# EAGLE design Breakoutboardv2 (EAGLE 6.6.0)

## Sheet 1 of 2
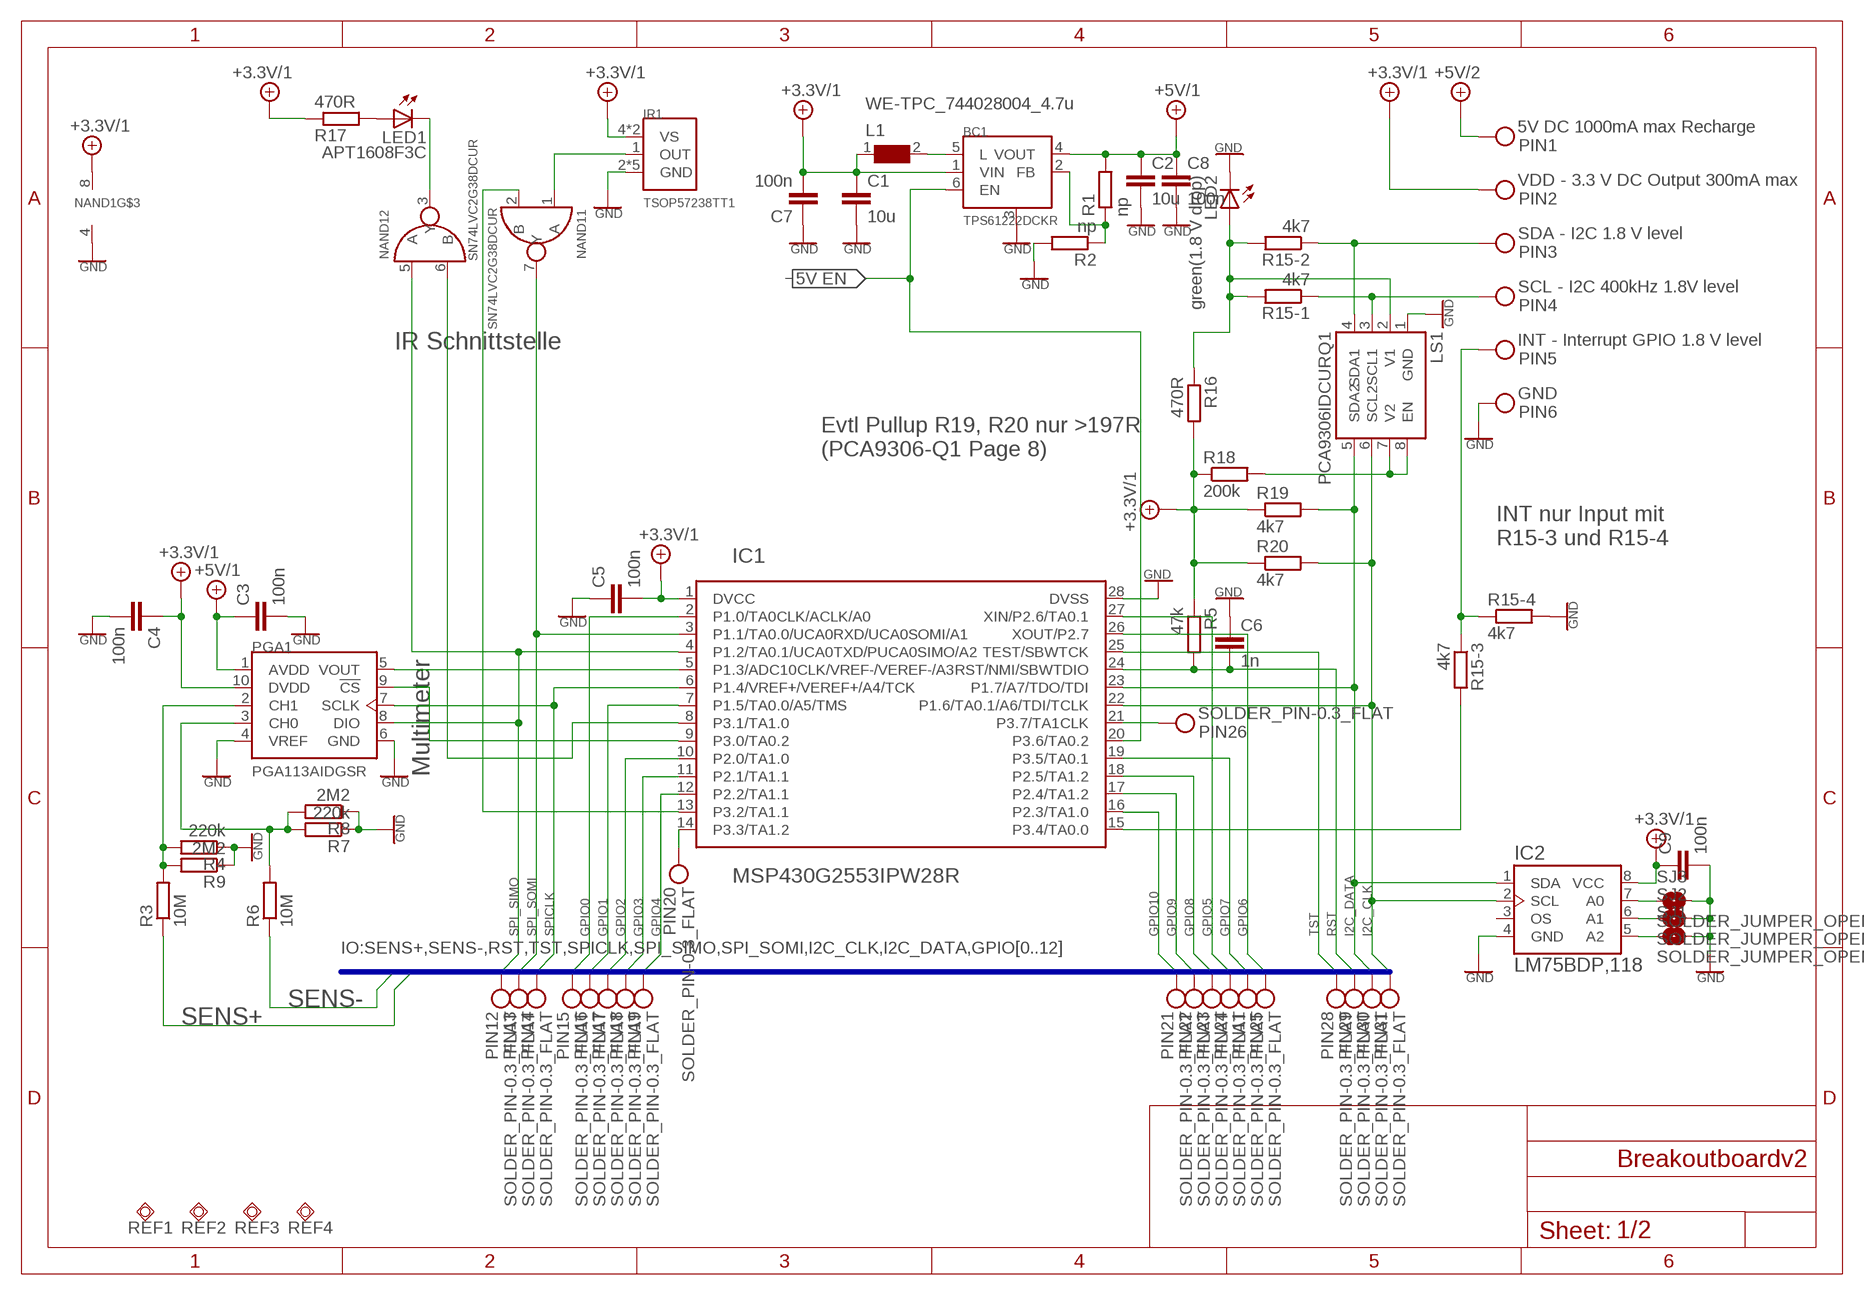
[diagram p0: schematic, sheet 1]

### Parts
BC1  TPS61222DCKR  [SOP65P210X110-6L]
C1  10u  C-EUC0805N  [CAPC2012X95N]
C2  10u  C-EUC0805N  [CAPC2012X95N]
C3  100n  C-EUC0603L  [CAPC1608X90L]
C4  100n  C-EUC0603L  [CAPC1608X90L]
C5  100n  C-EUC0603L  [CAPC1608X90L]
C6  1n  C-EUC0603L  [CAPC1608X90L]
C7  100n  C-EUC0603L  [CAPC1608X90L]
C8  100n  C-EUC0603L  [CAPC1608X90L]
C9  100n  C-EUC0603L  [CAPC1608X90L]
IC1  MSP430G2553IPW28R  [SOP65P640X120-28L]
IC2  LM75BDP,118  [SOP65P400X130-8L]
IR1  TSOP57238TT1  [TSOP572]
L1  WE-TPC_744028004_4.7u  WE-TPC_2811/2813  [WE-TPC_2811/2813]
LED1  APT1608F3C  LED0603  [LED-0603]
LED2  green(1.8 V drop)  LED0603  [LED-0603]
LS1  PCA9306IDCURQ1  [SOP50P310X90-8L]
NAND1  SN74LVC2G38DCUR  [SOP50P310X90-8L]
PGA1  PGA113AIDGSR  [SOP50P490X110-10L]
PIN1  5V DC 1000mA max Recharge  SOLDER_PIN-1.0_FLAT  [SOLDER_PIN_1_FLAT]
PIN2  VDD - 3.3 V DC Output 300mA max  SOLDER_PIN-1.0_FLAT  [SOLDER_PIN_1_FLAT]
PIN3  SDA - I2C 1.8 V level  SOLDER_PIN-1.0_FLAT  [SOLDER_PIN_1_FLAT]
PIN4  SCL - I2C 400kHz 1.8V level  SOLDER_PIN-1.0_FLAT  [SOLDER_PIN_1_FLAT]
PIN5  INT - Interrupt GPIO 1.8 V level  SOLDER_PIN-1.0_FLAT  [SOLDER_PIN_1_FLAT]
PIN6  GND  SOLDER_PIN-1.0_FLAT  [SOLDER_PIN_1_FLAT]
PIN11  SOLDER_PIN-0.3_FLAT  [SOLDER_PIN_0.3_FLAT]
PIN12  SOLDER_PIN-0.3_FLAT  [SOLDER_PIN_0.3_FLAT]
PIN13  SOLDER_PIN-0.3_FLAT  [SOLDER_PIN_0.3_FLAT]
PIN14  SOLDER_PIN-0.3_FLAT  [SOLDER_PIN_0.3_FLAT]
PIN15  SOLDER_PIN-0.3_FLAT  [SOLDER_PIN_0.3_FLAT]
PIN16  SOLDER_PIN-0.3_FLAT  [SOLDER_PIN_0.3_FLAT]
PIN17  SOLDER_PIN-0.3_FLAT  [SOLDER_PIN_0.3_FLAT]
PIN18  SOLDER_PIN-0.3_FLAT  [SOLDER_PIN_0.3_FLAT]
PIN19  SOLDER_PIN-0.3_FLAT  [SOLDER_PIN_0.3_FLAT]
PIN20  SOLDER_PIN-0.3_FLAT  [SOLDER_PIN_0.3_FLAT]
PIN21  SOLDER_PIN-0.3_FLAT  [SOLDER_PIN_0.3_FLAT]
PIN22  SOLDER_PIN-0.3_FLAT  [SOLDER_PIN_0.3_FLAT]
PIN23  SOLDER_PIN-0.3_FLAT  [SOLDER_PIN_0.3_FLAT]
PIN24  SOLDER_PIN-0.3_FLAT  [SOLDER_PIN_0.3_FLAT]
PIN25  SOLDER_PIN-0.3_FLAT  [SOLDER_PIN_0.3_FLAT]
PIN26  SOLDER_PIN-0.3_FLAT  [SOLDER_PIN_0.3_FLAT]
PIN28  SOLDER_PIN-0.3_FLAT  [SOLDER_PIN_0.3_FLAT]
PIN29  SOLDER_PIN-0.3_FLAT  [SOLDER_PIN_0.3_FLAT]
PIN30  SOLDER_PIN-0.3_FLAT  [SOLDER_PIN_0.3_FLAT]
PIN31  SOLDER_PIN-0.3_FLAT  [SOLDER_PIN_0.3_FLAT]
R1  np  R-EU-R0603L  [RESC1608X45L]
R2  np  R-EU-R0603L  [RESC1608X45L]
R3  10M  R-EU-R0603L  [RESC1608X45L]
R4  220k  R-EU-R0603L  [RESC1608X45L]
R5  47k  R-EU-R0603L  [RESC1608X45L]
R6  10M  R-EU-R0603L  [RESC1608X45L]
R7  220k  R-EU-R0603L  [RESC1608X45L]
R8  2M2  R-EU-R0603L  [RESC1608X45L]
R9  2M2  R-EU-R0603L  [RESC1608X45L]
R15  4k7  CTS-74,2C083  [R_ARRAY_742]
R16  470R  R-EU-R0603L  [RESC1608X45L]
R17  470R  R-EU-R0603L  [RESC1608X45L]
R18  200k  R-EU-R0603L  [RESC1608X45L]
R19  4k7  R-EU-R0603L  [RESC1608X45L]
R20  4k7  R-EU-R0603L  [RESC1608X45L]
REF1  PCB-REF-1.27  [PCB-REF]
REF2  PCB-REF-1.27  [PCB-REF]
REF3  PCB-REF-1.27  [PCB-REF]
REF4  PCB-REF-1.27  [PCB-REF]
SJ1  SOLDER_JUMPER_OPEN  [SJ-O]
SJ2  SOLDER_JUMPER_OPEN  [SJ-O]
SJ3  SOLDER_JUMPER_OPEN  [SJ-O]

### Nets
5VEN: BC1.6(EN) IC1.20(P3.6/TA0.2)
+3.3V/1: BC1.1(VIN) C1.1 C4.1 C5.2 C7.2 C9.1 IC1.1(DVCC) IC2.8(VCC) IR1.4(VS) IR1.5(VS) L1.1 NAND1.8(VDD) PGA1.10(DVDD) PIN2._(PIN) R5.1 R16.2 R17.1 R18.1 R19.1 R20.1 ; also sheet 2
+5V/1: BC1.4(VOUT) C2.1 C3.1 C8.1 PGA1.1(AVDD) R1.2 ; also sheet 2
+5V/2: PIN1._(PIN) ; also sheet 2
CS_PGA: IC1.9(P3.0/TA0.2) PGA1.9(!CS)
GND: BC1.3(GND) C1.2 C2.2 C3.2 C4.2 C5.1 C6.1 C7.1 C8.2 C9.2 IC1.28(DVSS) IC2.4(GND) IR1.2(GND) IR1.3(GND) IR1.6(GND) IR1.7(GND) IR1.8(GND) LED2.C LS1.1(GND) NAND1.4(GND) PGA1.4(VREF) PGA1.6(GND) PIN6._(PIN) R2.2 R4.1 R7.1 R8.1 R9.1 R15.5 SJ1.2 SJ2.2 SJ3.2 ; also sheet 2
GPIO0: IC1.2(P1.0/TA0CLK/ACLK/A0) PIN15._(PIN) ; also sheet 2
GPIO1: IC1.7(P1.5/TA0.0/A5/TMS) PIN16._(PIN) ; also sheet 2
GPIO2: IC1.10(P2.0/TA1.0) PIN17._(PIN) ; also sheet 2
GPIO3: IC1.11(P2.1/TA1.1) PIN18._(PIN) ; also sheet 2
GPIO4: IC1.12(P2.2/TA1.1) PIN19._(PIN) ; also sheet 2
GPIO5: IC1.27(XIN/P2.6/TA0.1) PIN24._(PIN) ; also sheet 2
GPIO6: IC1.26(XOUT/P2.7) PIN25._(PIN) ; also sheet 2
GPIO7: IC1.19(P3.5/TA0.1) PIN11._(PIN) ; also sheet 2
GPIO8: IC1.18(P2.5/TA1.2) PIN23._(PIN) ; also sheet 2
GPIO9: IC1.17(P2.4/TA1.2) PIN22._(PIN) ; also sheet 2
GPIO10: IC1.16(P2.3/TA1.0) PIN21._(PIN) ; also sheet 2
I2C_CLK: IC1.22(P1.6/TA0.1/A6/TDI/TCLK) IC2.2(SCL) LS1.6(SCL2) PIN31._(PIN) R20.2 ; also sheet 2
I2C_DATA: IC1.23(P1.7/A7/TDO/TDI) IC2.1(SDA) LS1.5(SDA2) PIN30._(PIN) R19.2 ; also sheet 2
INT_JOLLA: IC1.15(P3.4/TA0.0) R15.6
IR-R_CONT: IC1.13(P3.2/TA1.1) NAND1.2(1:B)
IR-T_CONT: IC1.8(P3.1/TA1.0) NAND1.6(2:B)
N$1: BC1.2(FB) R1.1 R2.1
N$2: BC1.5(L) L1.2
N$3: IC2.7(A0) SJ3.1
N$4: PGA1.2(CH1) R3.2 R4.2 R9.2
N$5: IC2.6(A1) SJ2.1
N$6: IC1.14(P3.3/TA1.2) PIN20._(PIN)
N$7: PGA1.3(CH0) R6.2 R7.2 R8.2
N$11: IC2.5(A2) SJ1.1
N$17: IC1.21(P3.7/TA1CLK) PIN26._(PIN)
N$18: LED1.A R17.2
N$19: PIN5._(PIN) R15.3 R15.4
N$21: LED2.A LS1.2(V1) R15.7 R15.8 R16.1
N$38: IR1.1(OUT) NAND1.1(1:A)
N$39: LED1.C NAND1.3(2:Y)
N$40: LS1.4(SDA1) PIN3._(PIN) R15.2
N$42: LS1.7(V2) LS1.8(EN) R18.2
N$43: LS1.3(SCL1) PIN4._(PIN) R15.1
RST: C6.2 IC1.24(RST/NMI/SBWTDIO) PIN29._(PIN) R5.2 ; also sheet 2
SENS+ [sens]: R3.1 ; also sheet 2
SENS- [sens]: R6.1 ; also sheet 2
SPI_SIMO: IC1.4(P1.2/TA0.1/UCA0TXD/PUCA0SIMO/A2) NAND1.5(2:A) PGA1.8(DIO) PIN12._(PIN) ; also sheet 2
SPI_SOMI: IC1.3(P1.1/TA0.0/UCA0RXD/UCA0SOMI/A1) NAND1.7(1:Y) PIN13._(PIN) ; also sheet 2
SPICLK: IC1.6(P1.4/VREF+/VEREF+/A4/TCK) PGA1.7(SCLK) PIN14._(PIN) ; also sheet 2
TST: IC1.25(TEST/SBWTCK) PIN28._(PIN) ; also sheet 2
VAD_SENSE: IC1.5(P1.3/ADC10CLK/VREF-/VEREF-/A3) PGA1.5(VOUT)
Unconnected: IC2.3(OS) REF1.0(PP) REF2.0(PP) REF3.0(PP) REF4.0(PP)

### Buses
IO:SENS+,SENS-,RST,TST,SPICLK,SPI_SIMO,SPI_SOMI,I2C_CLK,I2C_DATA,GPIO[0..12]

### Notes on the sheet
- IR Schnittstelle
- Evtl Pullup R19, R20 nur >197R
  (PCA9306-Q1 Page 8)
- INT nur Input mit
  R15-3 und R15-4
- Multimeter

## Sheet 2 of 2
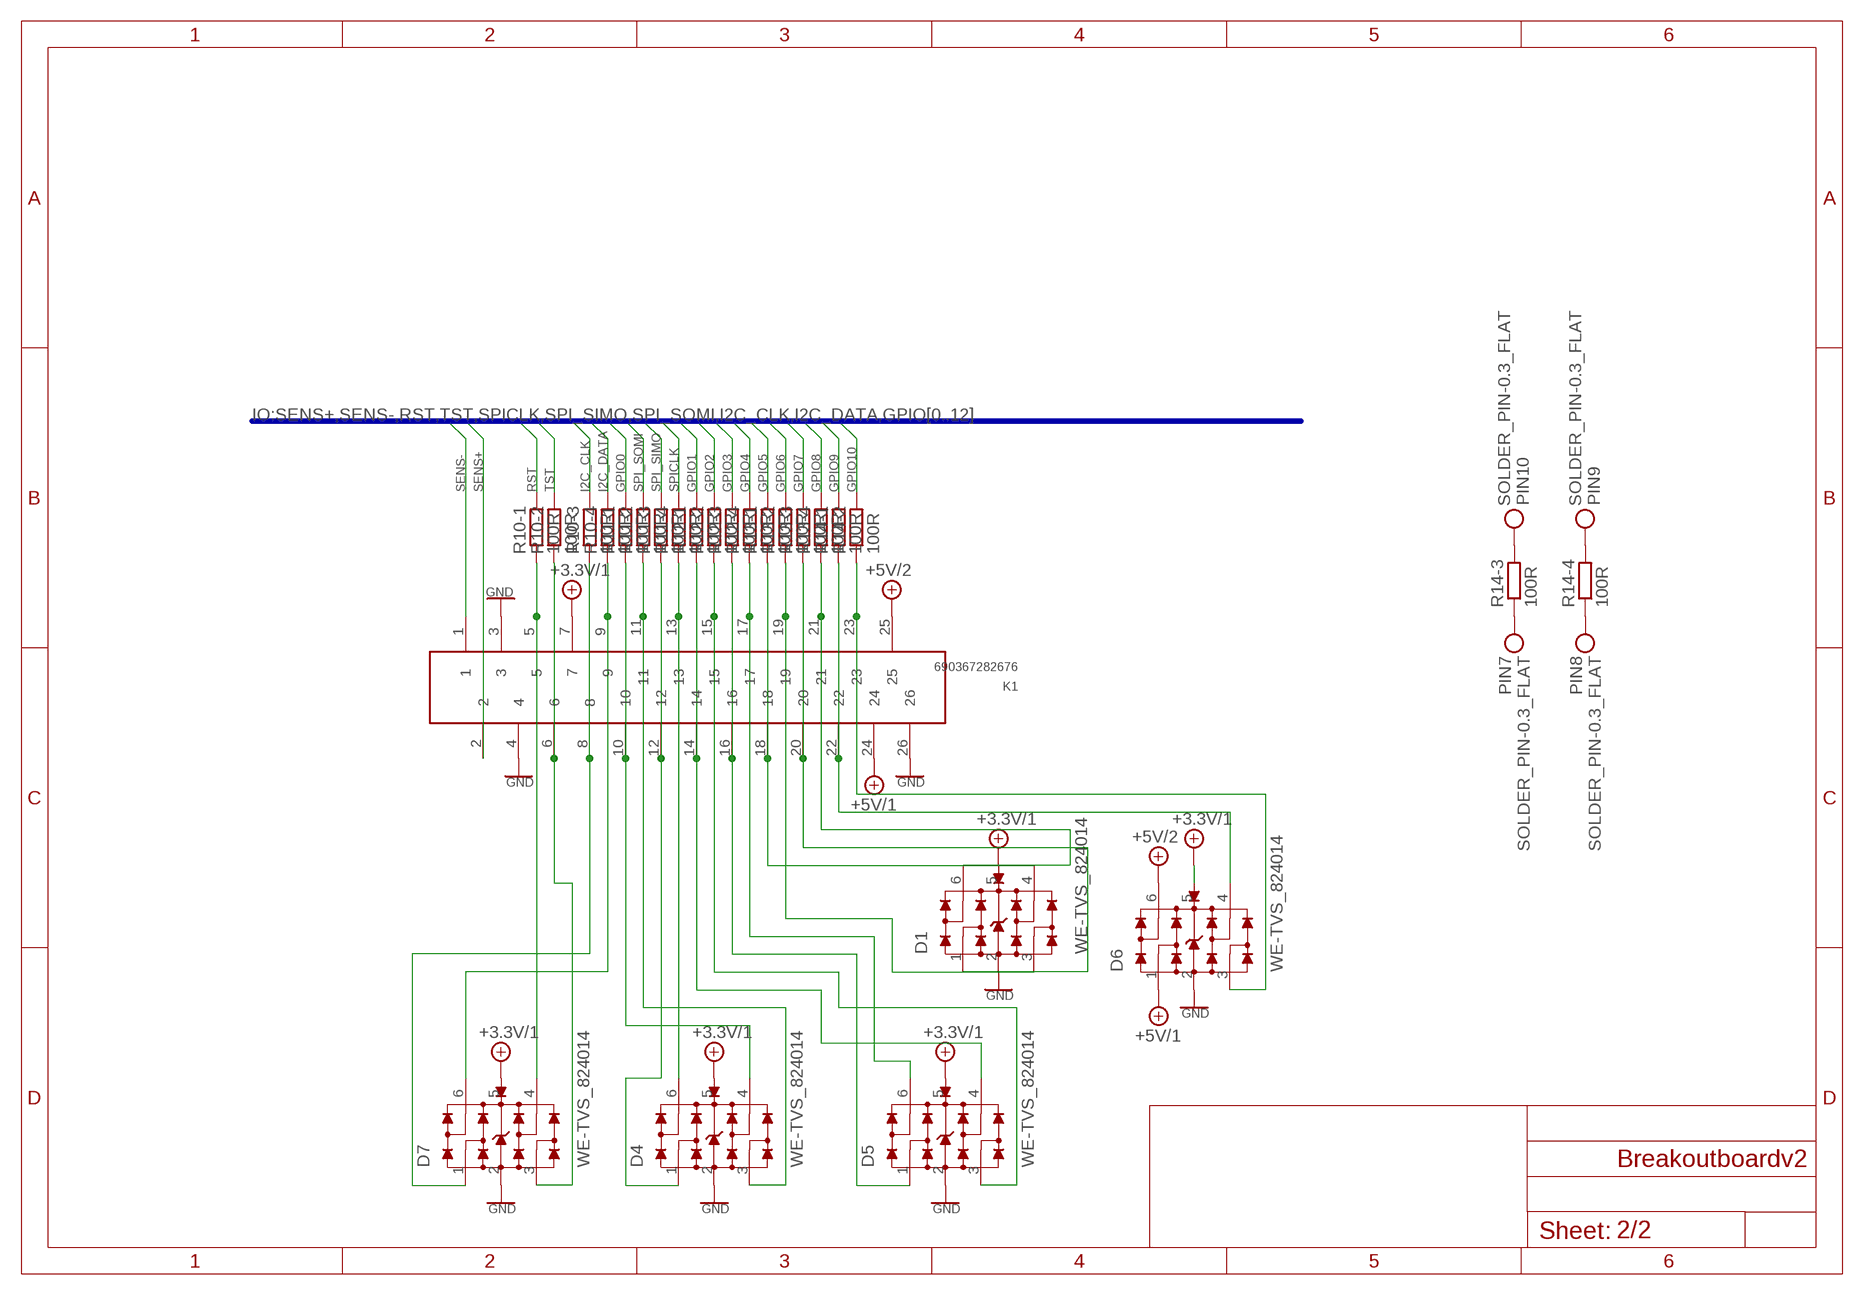
[diagram p1: schematic, sheet 2]

### Parts
D1  WE-TVS_824014  [WE-TVS_SOT23-6L]
D4  WE-TVS_824014  [WE-TVS_SOT23-6L]
D5  WE-TVS_824014  [WE-TVS_SOT23-6L]
D6  WE-TVS_824014  [WE-TVS_SOT23-6L]
D7  WE-TVS_824014  [WE-TVS_SOT23-6L]
K1  690367282676  [690367282676]
PIN7  SOLDER_PIN-0.3_FLAT  [SOLDER_PIN_0.3_FLAT]
PIN8  SOLDER_PIN-0.3_FLAT  [SOLDER_PIN_0.3_FLAT]
PIN9  SOLDER_PIN-0.3_FLAT  [SOLDER_PIN_0.3_FLAT]
PIN10  SOLDER_PIN-0.3_FLAT  [SOLDER_PIN_0.3_FLAT]
R10  100R  CTS-74,2C083  [R_ARRAY_742]
R11  100R  CTS-74,2C083  [R_ARRAY_742]
R12  100R  CTS-74,2C083  [R_ARRAY_742]
R13  100R  CTS-74,2C083  [R_ARRAY_742]
R14  100R  CTS-74,2C083  [R_ARRAY_742]

### Nets
+3.3V/1: D1.5(VDD) D4.5(VDD) D5.5(VDD) D6.5(VDD) D7.5(VDD) K1.7 ; also sheet 1
+5V/1: D6.1 K1.24 ; also sheet 1
+5V/2: D6.6 K1.25 ; also sheet 1
GND: D1.2(GND) D4.2(GND) D5.2(GND) D6.2(GND) D7.2(GND) K1.3 K1.4 K1.26 ; also sheet 1
GPIO0: R11.8 ; also sheet 1
GPIO1: R12.8 ; also sheet 1
GPIO2: R12.7 ; also sheet 1
GPIO3: R12.6 ; also sheet 1
GPIO4: R12.5 ; also sheet 1
GPIO5: R13.8 ; also sheet 1
GPIO6: R13.7 ; also sheet 1
GPIO7: R13.6 ; also sheet 1
GPIO8: R13.5 ; also sheet 1
GPIO9: R14.8 ; also sheet 1
GPIO10: R14.7 ; also sheet 1
I2C_CLK: R10.6 ; also sheet 1
I2C_DATA: R10.5 ; also sheet 1
N$8: D7.1 K1.8 R10.3
N$9: D7.6 K1.9 R10.4
N$10: D4.4 K1.10 R11.1
N$12: D4.1 K1.12 R11.3
N$13: D4.6 K1.13 R11.4
N$14: D5.4 K1.14 R12.1
N$15: D5.3 K1.15 R12.2
N$16: D5.1 K1.16 R12.3
N$24: D7.4 K1.5 R10.1
N$25: D7.3 K1.6 R10.2
N$26: D4.3 K1.11 R11.2
N$27: D5.6 K1.17 R12.4
N$28: D1.4 K1.18 R13.1
N$29: D1.3 K1.19 R13.2
N$30: D1.1 K1.20 R13.3
N$31: D1.6 K1.21 R13.4
N$32: D6.4 K1.22 R14.1
N$33: D6.3 K1.23 R14.2
N$34: PIN7._(PIN) R14.3
N$35: PIN8._(PIN) R14.4
N$36: PIN9._(PIN) R14.5
N$37: PIN10._(PIN) R14.6
RST: R10.8 ; also sheet 1
SENS+ [sens]: K1.2 ; also sheet 1
SENS- [sens]: K1.1 ; also sheet 1
SPI_SIMO: R11.6 ; also sheet 1
SPI_SOMI: R11.7 ; also sheet 1
SPICLK: R11.5 ; also sheet 1
TST: R10.7 ; also sheet 1

### Buses
IO:SENS+,SENS-,RST,TST,SPICLK,SPI_SIMO,SPI_SOMI,I2C_CLK,I2C_DATA,GPIO[0..12]

## Library data of the parts
BC1 = MasterPhonebot:TPS61222?*: TPS61222 Description The TPS6122x family devices provide a power-supply solution for products powered by either a single-cell, two-cell, or three-cell alkaline, NiCd or NiMH, or one-cell Li-Ion or Li-polymer battery. Possible output currents depend on the input-to-output voltage ratio. The boost converter is based on a hysteretic controller topology using synchronous rectification to obtain maximum efficiency at minimal quiescent currents. The output voltage of the adjustable version can be programmed by an external resistor divider, or is set internally to a fixed output voltage. The converter can be switched off by a featured enable pin. While being switched off, battery drain is minimized. The device is offered in a 6-pin SC-70 package (DCK) measuring 2 mm × 2 mm to enable small circuit layout size. Features Up to 95% Efficiency at Typical Operating Conditions 5.5 µA Quiescent Current Startup Into Load at 0.7 V Input Voltage Operating Input Voltage from 0.7 V to 5.5 V Pass-Through Function during Shutdown Minimum Switching Current 200 mA Protections: Output Overvoltage Overtemperature Input Undervoltage Lockout Adjustable Output Voltage from 1.8 V to 6 V Fixed Output Voltage Versions Small 6-pin SC-70 Package Details see: Datasheet <http://www.ti.com/lit/ds/symlink/tps61222.pdf> www.ti.com <http://www.ti.com/product/TPS61222> Created: L.Lischke 2015-03-21 (c) KK-Prime Engineering GmbH; SPQ: 3000
C1-C9 = MasterPhonebot:C-EU: Capacitor, European Symbol
D1 D4-D7 = MasterPhonebot:WE-TVS_824014: TVS Diode Array WE-TVS, Super Speed Serie - Low capazity - No leakage current - Low clamping voltage - high ESD voltage protection -- SATA -- DisplayPort -- DVI -- HDMI <http://katalog.we-online.de/media/images/eisos/VarTVS_highspeed_pf2.jpg.jpg> Details see: http://katalog.we-online.de/en/pbs/WE-TVS_High_Speed? Updated by Dan Xu 2014-07-11 2014 (C) Würth Elektronik
IC1 = MasterPhonebot:MSP430G2*53?28R: MSP430G2x53 Description The Texas Instruments MSP430 family of ultra-low-power microcontrollers consists of several devices featuring different sets of peripherals targeted for various applications. The architecture, combined with five low-power modes, is optimized to achieve extended battery life in portable measurement applications. The device features a powerful 16-bit RISC CPU, 16-bit registers, and constant generators that contribute to maximum code efficiency. The digitally controlled oscillator (DCO) allows wake-up from low-power modes to active mode in less than 1 µs. The MSP430G2x13 and MSP430G2x53 series are ultra-low-power mixed signal microcontrollers with built-in 16-bit timers, up to 24 I/O capacitive-touch enabled pins, a versatile analog comparator, and built-in communication capability using the universal serial communication interface. In addition the MSP430G2x53 family members have a 10-bit analog-to-digital (A/D) converter. For configuration details see . Typical applications include low-cost sensor systems that capture analog signals, convert them to digital values, and then process the data for display or for transmission to a host system. Features Low Supply-Voltage Range: 1.8 V to 3.6 V Ultra-Low Power Consumption Active Mode: 230 µA at 1 MHz, 2.2 V Standby Mode: 0.5 µA Off Mode (RAM Retention): 0.1 µA Five Power-Saving Modes Ultra-Fast Wake-Up From Standby Mode in Less Than 1 µs 16-Bit RISC Architecture, 62.5-ns Instruction Cycle Time Basic Clock Module Configurations Internal Frequencies up to 16 MHz With Four Calibrated Frequency Internal Very-Low-Power Low-Frequency (LF) Oscillator 32-kHz Crystal External Digital Clock Source Two 16-Bit Timer_A With Three Capture/Compare Registers Up to 24 Capacitive-Touch Enabled I/O Pins Universal Serial Communication Interface (USCI) Enhanced UART Supporting Auto Baudrate Detection (LIN) IrDA Encoder and Decoder Synchronous SPI I2C™ On-Chip Comparator for Analog Signal Compare Function or Slope Analog-to-Digital (A/D) Conversion 10-Bit 200-ksps Analog-to-Digital (A/D) Converter With Internal Reference, Sample-and-Hold, and Autoscan Brownout Detector Serial Onboard Programming, No External Programming Voltage Needed, Programmable Code Protection by Security Fuse On-Chip Emulation Logic With Spy-Bi-Wire Interface Package Options TSSOP: 20 Pin, 28 Pin PDIP: 20 Pin QFN: 32 Pin Details see: Datasheet <http://www.ti.com/lit/ds/symlink/msp430g2553.pdf> General Information: www.ti.com <http://www.ti.com/product/msp430g2553> Created: L.Lischke 2015-03-21 (c) KK-Prime Engineering GmbH
IC2 = MasterPhonebot:LM75B?*: LM75B Description The LM75B is a temperature-to-digital converter using an on-chip band gap temperature sensor and Sigma-Delta A-to-D conversion technique with an overtemperature detection output. The LM75B contains a number of data registers: Configuration register (Conf) to store the device settings such as device operation mode, OS operation mode, OS polarity and OS fault queue; temperature register (Temp) to store the digital temp reading, and set-point registers (Tos and Thyst) to store programmable overtemperature shutdown and hysteresis limits, that can be communicated by a controller via the 2-wire serial I²C-bus interface. The device also includes an open-drain output (OS) which becomes active when the temperature exceeds the programmed limits. There are three selectable logic address pins so that eight devices can be connected on the same bus without address conflict. The LM75B can be configured for different operation conditions. It can be set in normal mode to periodically monitor the ambient temperature, or in shutdown mode to minimize power consumption. The OS output operates in either of two selectable modes: OS comparator mode or OS interrupt mode. Its active state can be selected as either HIGH or LOW. The fault queue that defines the number of consecutive faults in order to activate the OS output is programmable as well as the set-point limits. The temperature register always stores an 11-bit two’s complement data giving a temperature resolution of 0.125 °C. This high temperature resolution is particularly useful in applications of measuring precisely the thermal drift or runaway. When the LM75B is accessed the conversion in process is not interrupted (that is, the I²C-bus section is totally independent of the Sigma-Delta converter section) and accessing the LM75B continuously without waiting at least one conversion time between communications will not prevent the device from updating the Temp register with a new conversion result. The new conversion result will be available immediately after the Temp register is updated. The LM75B powers up in the normal operation mode with the OS in comparator mode, temperature threshold of 80 °C and hysteresis of 75 °C, so that it can be used as a stand-alone thermostat with those pre-defined temperature set points. Features Pin-for-pin replacement for industry standard LM75 and LM75A and offers improved temperature resolution of 0.125 °C and specification of a single part over power supply range from 2.8 V to 5.5 V I²C-bus interface with up to 8 devices on the same bus Power supply range from 2.8 V to 5.5 V Temperatures range from -55 °C to +125 °C Frequency range 20 Hz to 400 kHz with bus fault time-out to prevent hanging up the bus 11-bit ADC that offers a temperature resolution of 0.125 °C Temperature accuracy of: ±2 °C from -25 °C to +100 °C ±3 °C from -55 °C to +125 °C Programmable temperature threshold and hysteresis set points Supply current of 1.0 uA in shutdown mode for power conservation Stand-alone operation as thermostat at power-up ESD protection exceeds 4500 V HBM per JESD22-A114 and 1000 V CDM per JESD22-C101 Latch-up testing is done to JEDEC Standard JESD78 which exceeds 100 mA Small 8-pin package types: SO8, TSSOP8, 3 mm x 2 mm XSON8U, and 2 mm x 3 mm HWSON8 Details see: Datasheet <http://www.nxp.com/documents/data_sheet/LM75B.pdf> More infos: www.nxp.com <http://www.nxp.com/products/interface_and_connectivity/i2c/i2c_temperature_voltage_monitors/LM75BDP.html> Created: L.Lischke 2015-04-05 (c) KK-Prime Engineering GmbH
IR1 = MasterPhonebot:TSOP57?*: IR-Receiver TSOP57xxxx Description IR Receiver Modules for Remote Control Systems Features Height of 0.8 mm ± 75° half angle sensitivity Low supply current Details see: Datasheet <http://www.vishay.com/docs/82434/tsop572.pdf> Further Details: www.vishay.com <http://www.vishay.com/product?docid=82646#geninf> Created: L.Lischke 2015-03-22 (c) KK-Prime-Engineering GmbH
K1 = MasterPhonebot:690367282676: WR-MM Female SMT Connector with Polarization, 26 Pins=>Code : Con_BTB_MM_Female_SMT_690367282676 <http://katalog.we-online.de/media/thumbs2/eican/thb_Con_BTB_MM_Female_SMT_69036728xx76_pf2.jpg> Details see: http://katalog.we-online.de/en/em/6903_6728_xx_76 Created 2014-06-04, Karrer Zheng 2014 (C) Würth Elektronik
L1 = MasterPhonebot:WE-TPC: Shielded Tiny Power Inductor WE-TPC - Extremely flat power inductor - High current capability - High reliability and perfect soldering characteristics because of integrated soldering pad - magnetically shielded -- Portable power like PDA, digital camera, PCMICA-cards and displays -- DC/DC-converter -- Recommended for switching regulator IC's from Linear Technology, National Semiconductor, Texas Instruments and Fairchild Semiconductor <http://katalog.we-online.de/media/images/eisos/IndTPC_pf2.jpg> Details see: http://katalog.we-online.de/en/pbs/WE-TPC? Updated by Dan Xu 2014-07-11 2014 (C) Würth Elektronik
LED1 LED2 = MasterPhonebot:LED: LEDs Standard schematic elements and footprints for 5mm, 3mm, 1206, and 0603 sized LEDs. 5mm - Spark Fun Electronics SKU : COM-00529 (and others)
LS1 = MasterPhonebot:PCA9306*?: I2C Levelshifter PCA9306-Q1 Description This dual bidirectional I2C and SMBus voltage-level translator, with an enable (EN) input, is operational from 1.2-V to 3.3-V VREF1 and 1.8-V to 5.5-V VREF2. The PCA9306 allows bidirectional voltage translations between 1.2 V and 5 V, without the use of a direction pin. The low ON-state resistance (ron) of the switch allows connections to be made with minimal propagation delay. When EN is high, the translator switch is ON, and the SCL1 and SDA1 I/O are connected to the SCL2 and SDA2 I/O, respectively, allowing bidirectional data flow between ports. When EN is low, the translator switch is off, and a high-impedance state exists between ports. In I2C applications, the bus capacitance limit of 400 pF restricts the number of devices and bus length. Using the PCA9306 enables the system designer to isolate two halves of a bus; thus, more I2C devices or longer trace length can be accommodated. The PCA9306 also can be used to run two buses, one at 400-kHz operating frequency and the other at 100-kHz operating frequency. If the two buses are operating at different frequencies, the 100-kHz bus must be isolated when the 400-kHz operation of the other bus is required. If the master is running at 400 kHz, the maximum system operating frequency may be less than 400 kHz because of the delays added by the repeater. As with the standard I2C system, pullup resistors are required to provide the logic high levels on the translator's bus. The PCA9306 has a standard open-collector configuration of the I2C bus. The size of these pullup resistors depends on the system, but each side of the repeater must have a pullup resistor. The device is designed to work with standard-mode and fast-mode I2C devices, in addition to SMBus devices. Standard-mode I2C devices only specify 3 mA in a generic I2C system where standard-mode devices and multiple masters are possible. Under certain conditions, high termination currents can be used. When the SDA1 or SDA2 port is low, the clamp is in the ON state, and a low resistance connection exists between the SDA1 and SDA2 ports. Assuming the higher voltage is on the SDA2 port when the SDA2 port is high, the voltage on the SDA1 port is limited to the voltage set by VREF1. When the SDA1 port is high, the SDA2 port is pulled to the drain pullup supply voltage (VDPU) by the pullup resistors. This functionality allows a seamless translation between higher and lower voltages selected by the user, without the need for directional control. The SCL1/SCL2 channel also functions as the SDA1/SDA2 channel. All channels have the same electrical characteristics, and there is minimal deviation from one output to another in voltage or propagation delay. This is a benefit over discrete transistor voltage translation solutions, since the fabrication of the switch is symmetrical. The translator provides excellent ESD protection to lower-voltage devices and at the same time protects less ESD-resistant devices. Features Qualified for Automotive Applications AEC-Q100 Qualified With the Following Results: Device Temperature Grade 2: –40°C to 105°C Device HBM ESD Classification Level H2 Device CDM ESD Classification Level C4B 2-Bit Bidirectional Translator for SDA and SCL Lines in Mixed-Mode I2C Applications I2C and SMBus Compatible Less Than 1.5-ns Maximum Propagation Delay to Accommodate Standard-Mode and Fast-Mode I2C Devices and Multiple Masters Allows Voltage-Level Translation Between 1.2-V VREF1 and 1.8-V, 2.5-V, 3.3-V, or 5-V VREF2 1.8-V VREF1 and 2.5-V, 3.3-V or 5-V VREF2 2.5-V VREF1 and 3.3-V or 5-V VREF2 3.3-V VREF1 and 5-V VREF2 Provides Bidirectional Voltage Translation With No Direction Pin Low 3.5-Ω ON-State Connection Between Input and Output Ports Provides Less Signal Distortion Open-Drain I2C I/O Ports (SCL1, SDA1, SCL2, and SDA2) 5-V Tolerant I2C I/O Ports to Support Mixed-Mode Signal Operation High-Impedance SCL1, SDA1, SCL2, and SDA2 Pins for EN = Low Lock-Up-Free Operation for Isolation When EN = Low Flow-Through Pinout for Ease of Printed Circuit Board Trace Routing Latch-Up Performance Exceeds 100 mA Per JESD 78, Class II ESD Protection Exceeds JESD 22 2000-V Human-Body Model (A114-A) 200-V Machine Model (A115-A) 1000-V Charged-Device Model (C101) Details see: Datasheet <http://www.ti.com/lit/ds/symlink/pca9306-q1.pdf> General Information: www.ti.com <http://www.ti.com/product/pca9306-q1> Created: L.Lischke 2015-03-23 (c) KK-Prime Engineering GmbH; OPTEMP: -40 to 85 °C
NAND1 = MasterPhonebot:SN74LVC2G38?*: SN74LVC2G38 Description The SN74LVC2G38 is designed for 1.65-V to 5.5-V VCC operation. This device is a dual two-input NAND buffer gate with open-drain outputs. It performs the Boolean function Y = A • B or Y = A + B in positive logic. NanoFree™ package technology is a major breakthrough in IC packaging concepts, using the die as the package. This device is fully specified for partial-power-down applications using Ioff. The Ioff circuitry disables the outputs, preventing damaging current backflow through the device when it is powered down. Features Available in the Texas Instruments NanoFree Package Supports 5-V VCC Operation Inputs Accept Voltages to 5.5 V Max tpd of 4 ns at 3.3 V Low Power Consumption, 10-μA Max ICC ±24-mA Output Drive at 3.3 V Typical VOLP (Output Ground Bounce) <0.8 V at VCC = 3.3 V, TA = 25°C Typical VOHV (Output VOH Undershoot) >2 V at VCC = 3.3 V, TA = 25°C Ioff Supports Live insertion, Partial-Power-Down Mode Operation and Back Drive Protection Latch-Up Performance Exceeds 100 mA Per JESD 78, Class II ESD Protection Exceeds JESD 22 2000-V Human-Body Model (A114-A) 200-V Machine Model (A115-A) 1000-V Charged-Device Model (C101) Details see: Datasheet <http://www.ti.com/lit/ds/symlink/sn74lvc2g38.pdf> General Details: www.ti.com <http://www.ti.com/product/sn74lvc2g38> Created: L.Lischke 2015-03-23 (c) KK-Prime Engineering GmbH
PGA1 = MasterPhonebot:PGA11: PGA113 Description The PGA112 and PGA113 (binary/scope gains) offer two analog inputs, a three-pin SPI interface, and software shutdown in an MSOP-10 package. The PGA116 and PGA117 (binary/scope gains) offer 10 analog inputs, a four-pin SPI interface with daisy-chain capability, and hardware and software shutdown in a TSSOP-20 package. All versions provide internal calibration channels for system-level calibration. The channels are tied to GND, 0.9VCAL, 0.1VCAL, and VREF, respectively. VCAL, an external voltage connected to Channel 0, is used as the system calibration reference. Binary gains are: 1, 2, 4, 8, 16, 32, 64, and 128; scope gains are: 1, 2, 5, 10, 20, 50, 100, and 200. Features Rail-to-Rail Input/Output Offset: 25µV (typ), 100µV (max) Zerø-Drift: 0.35µV/°C (typ), 1.2µV/°C (max) Low Noise: 12nV/√Hz Input Offset Current: ±5nA max (+25°C) Gain Error: 0.1% max (G ≤ 32), 0.3% max (G > 32) Binary Gains: 1, 2, 4, 8, 16, 32, 64, 128(PGA112, PGA116) Scope Gains: 1, 2, 5, 10, 20, 50, 100, 200 (PGA113, PGA117) Gain Switching Time: 200ns Two Channel MUX: PGA112, PGA113 10 Channel MUX: PGA116, PGA117 Four Internal Calibration Channels Amplifier Optimized for Driving CDAC ADCs Output Swing: 50mV to Supply Rails AVDD and DVDD for Mixed Voltage Systems IQ = 1.1mA (typ) Software/Hardware Shutdown: IQ ≤ 4µA (typ) Temperature Range: -40°C to +125°C SPI Interface (10MHz) with Daisy-Chain Capability APPLICATIONS Remote e-Meter Reading Automatic Gain Control Portable Data Acquisition PC-Based Signal Acquisition Systems Test and Measurement Programmable Logic Controllers Battery-Powered Instruments Handheld Test Equipment Details see: Datasheet <http://www.ti.com/lit/ds/symlink/pga113.pdf> General Informations: www.ti.com <http://www.ti.com/product/PGA113> Created: L.Lischke 2015-03-21 (c) KK-Prime Engineering GmbH; GAINS: Scope
PIN1-PIN26 PIN28-PIN31 = MasterPhonebot:SOLDER_PIN: Simple Solder pin Created G. Klenner, 2013 (C) K&K Prime Engineering GmbH
R1-R9 R16-R20 = MasterPhonebot:R-EU: Resistor, European Symbol
R10-R15 = MasterPhonebot:CTS-74: Chip Resistor Arrays Series 74x Features Low Cost Thick Film Technology High Density Packaging Low Profile; can be used in PCMCIA cards Leadless Surface Mount Construction Concave or Convex Terminations Solder Coated Nickel Barrier Pads Isolated and Bussed Circuits Resistor Arrays Require Fewer Placements Than Discrete Components Tape and Reel Packaging RoHS Compliant in Accordance with EU Directive 2005/95/EC View All Features in Datasheet <http://www.ctscorp.com/components/Datasheets/CTSChipArrayDs.pdf> Details see: www.ctscorp.com Created A. Bachmaier, K&K Prime Engineering GmbH (c) 2011; 0_HOUSING: 1206; 0_MANUF: CTS; 1_DISTR: Digi-Key; 1_PN: 742C083103JPCT-ND
REF1-REF4 = MasterPhonebot:PCB-REF: reference point for PCB population Created G. Klenner, 2011-09-21 (c) K&K Prime Engineering GmbH
SJ1-SJ3 = MasterPhonebot:SOLDER_JUMPER: SMD solder JUMPER

## Net classes
1 sens: width 0.3 mm, drill 0.6 mm, clearance 1 mm

## Board
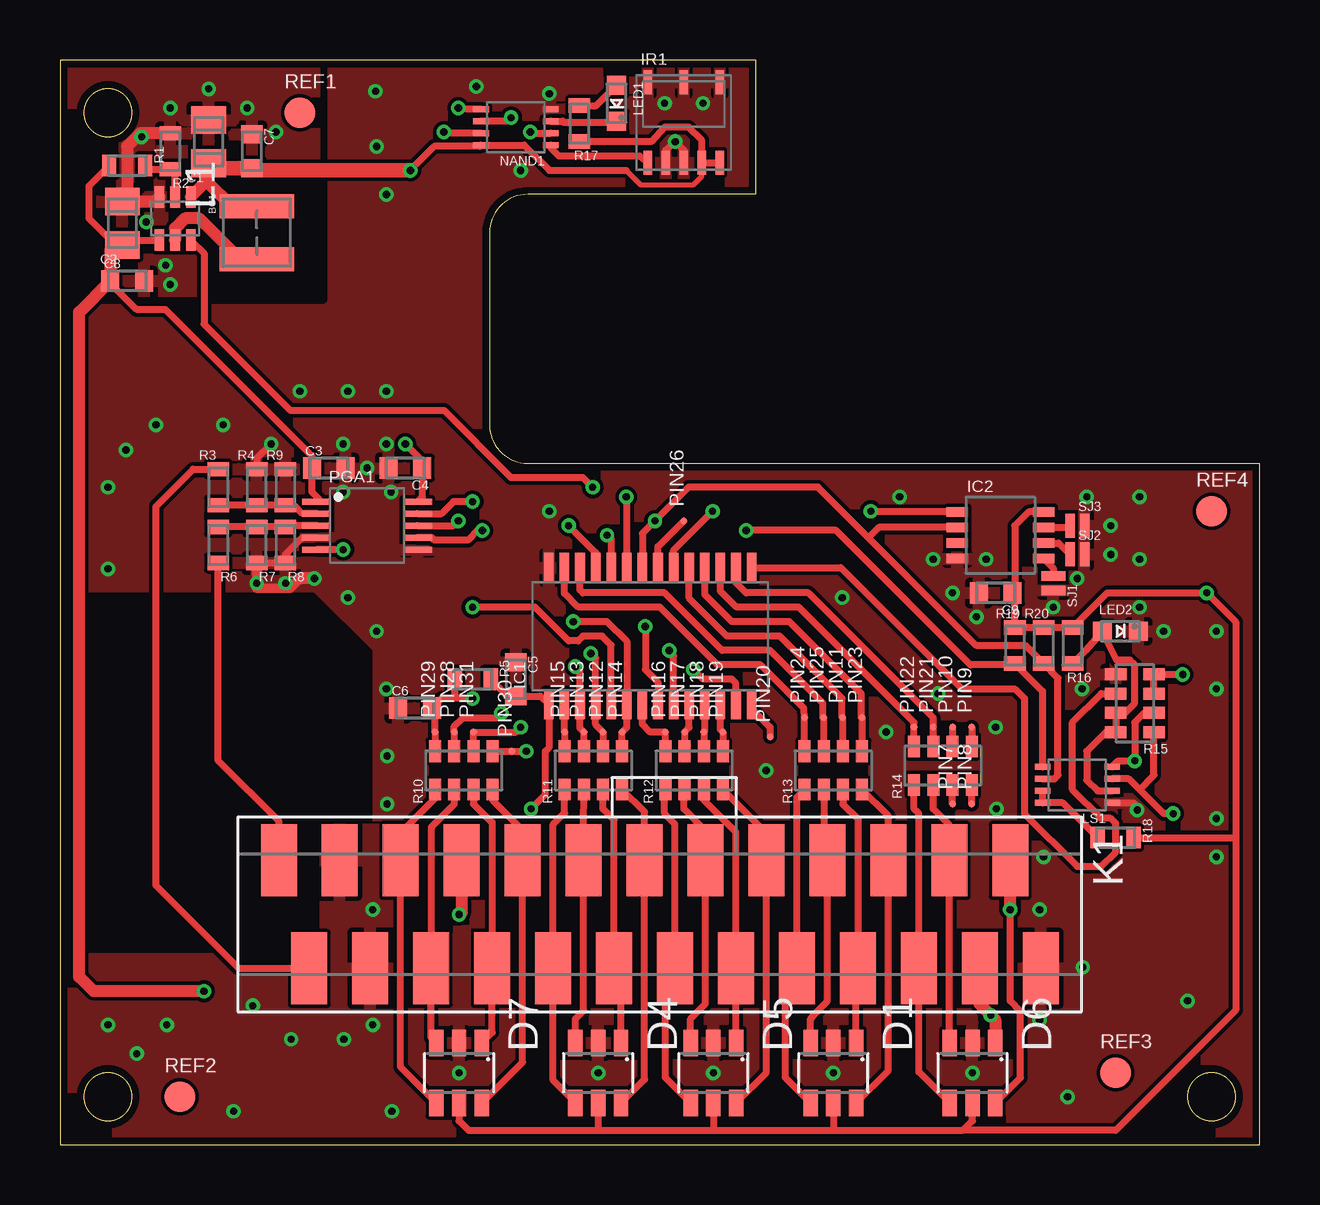
[diagram p2: board, top side]
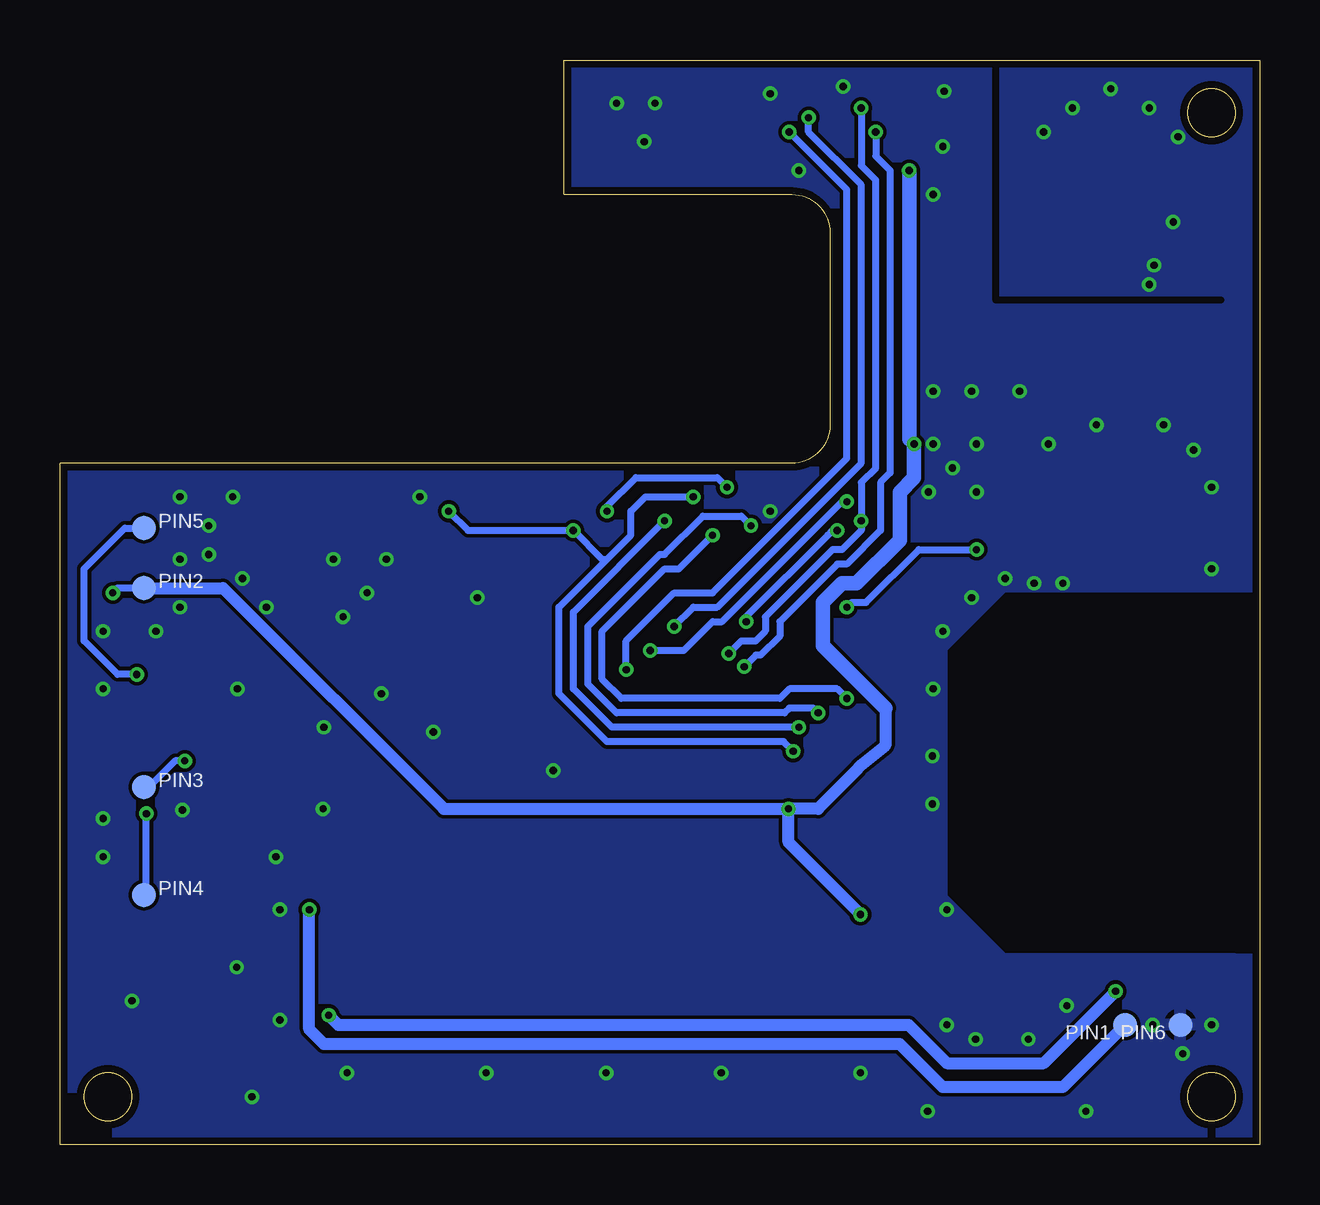
[diagram p3: board, bottom side, seen from below]

Size 50 x 45.2 mm. Coordinates in mm from the lower left corner, seen from the top.
Outline: 0,0 50,0 50,28.4 19.5,28.4 arc-90 17.9,30 17.9,38 arc-90 19.5,39.6 29,39.6 29,45.2 0,45.2 0,0
Outline: circle at 2,43 radius 1
Outline: circle at 2,2 radius 1
Outline: circle at 48,2 radius 1
Copper layers (1*16): Top 0.035mm / dielectric 1.5mm / Bottom 0.035mm
Design rules "Eagle-DRU - 1109 - LeitOn - 01 and 02 layers KK": minimum track width 0.15mm, minimum drill 0.3mm, track to track 0.15mm, track to pad 0.15mm, pad to pad 0.15mm, via to via 0.15mm, smd to smd 0.15mm, copper to edge 0.3mm, drill to drill 0.3mm, minimum pad ring 0.15mm, minimum via ring 0.15mm, stop-mask expansion 0.05mm, vias tented up to drill 0.3mm, thermal gap 0.2mm
tRestrict: area 1,8 to 13,23; 3 lines
bRestrict: area 1,8 to 13,23; 4 lines

### Footprints (pad centres in the part's own frame; a part is rotated, then mirrored left to right if it is on the bottom)
SOP65P210X110-6L = smd 0.9 x 0.4: 1 -0.9,0.65; 2 -0.9,0; 3 -0.9,-0.65; 4 0.9,-0.65; 5 0.9,0; 6 0.9,0.65
CAPC2012X95N = smd 1.15 x 1.45: 1 0.9,0; 2 -0.9,0
CAPC1608X90L = smd 0.75 x 0.9: 1 -0.7,0; 2 0.7,0
WE-TVS_SOT23-6L = smd 0.6 x 1.1: 1 -0.95,-1.25; 2 0,-1.25; 3 0.95,-1.25; 4 0.95,1.25; 5 0,1.25; 6 -0.95,1.25
SOP65P640X120-28L = smd 1.25 x 0.4: 1 -2.85,4.225; 2 -2.85,3.575; 3 -2.85,2.925; 4 -2.85,2.275; 5 -2.85,1.625; 6 -2.85,0.975; 7 -2.85,0.325; 8 -2.85,-0.325; 9 -2.85,-0.975; 10 -2.85,-1.625; 11 -2.85,-2.275; 12 -2.85,-2.925; 13 -2.85,-3.575; 14 -2.85,-4.225; 15 2.85,-4.225; 16 2.85,-3.575; 17 2.85,-2.925; 18 2.85,-2.275; 19 2.85,-1.625; 20 2.85,-0.975; 21 2.85,-0.325; 22 2.85,0.325; 23 2.85,0.975; 24 2.85,1.625; 25 2.85,2.275; 26 2.85,2.925; 27 2.85,3.575; 28 2.85,4.225
SOP65P400X130-8L = smd 0.9 x 0.4: 1 -1.8,0.975; 2 -1.8,0.325; 3 -1.8,-0.325; 4 -1.8,-0.975; 5 1.8,-0.975; 6 1.8,-0.325; 7 1.8,0.325; 8 1.8,0.975
TSOP572 = smd 0.35 x 1: 1 -1.5,-1.675; 2 -0.75,-1.675; 3 0,-1.675; 4 0.75,-1.675; 5 1.5,-1.675; 6 1.5,1.675; 7 0,1.675; 8 -1.5,1.675
690367282676 = smd 1.5 x 3: 1 15.875,-2.25; 2 14.605,2.25; 3 13.335,-2.25; 4 12.065,2.25; 5 10.795,-2.25; 6 9.525,2.25; 7 8.255,-2.25; 8 6.985,2.25; 9 5.715,-2.25; 10 4.445,2.25; 11 3.175,-2.25; 12 1.905,2.25; 13 0.635,-2.25; 14 -0.635,2.25; 15 -1.905,-2.25; 16 -3.175,2.25; 17 -4.445,-2.25; 18 -5.715,2.25; 19 -6.985,-2.25; 20 -8.255,2.25; 21 -9.525,-2.25; 22 -10.795,2.25; 23 -12.065,-2.25; 24 -13.335,2.25; 25 -14.605,-2.25; 26 -15.875,2.25
WE-TPC_2811/2813 = smd 1 x 3.1: 1 -1.1,0; 2 1.1,0
LED-0603 = smd 0.8 x 0.8: A 0,-0.75; C 0,0.75
SOP50P310X90-8L = smd 0.65 x 0.25: 1 -1.45,0.75; 2 -1.45,0.25; 3 -1.45,-0.25; 4 -1.45,-0.75; 5 1.45,-0.75; 6 1.45,-0.25; 7 1.45,0.25; 8 1.45,0.75
SOP50P490X110-10L = smd 1.2 x 0.25: 1 -2.1,1; 2 -2.1,0.5; 3 -2.1,0; 4 -2.1,-0.5; 5 -2.1,-1; 6 2.1,-1; 7 2.1,-0.5; 8 2.1,0; 9 2.1,0.5; 10 2.1,1
SOLDER_PIN_1_FLAT = smd 1 x 1: _ 0,0
SOLDER_PIN_0.3_FLAT = smd 0.3 x 0.3: _ 0,0
RESC1608X45L = smd 0.6 x 0.9: 1 -0.75,0; 2 0.75,0
R_ARRAY_742 = smd 0.5 x 0.9: 1 -1.2,-0.8; 2 -0.4,-0.8; 3 0.4,-0.8; 4 1.2,-0.8; 5 1.2,0.8; 6 0.4,0.8; 7 -0.4,0.8; 8 -1.2,0.8
PCB-REF = smd 1.27 x 1.27: 0 0,0
SJ-O = smd 0.4 x 1: 1 -0.3,0; 2 0.3,0

### Placement (x,y rotation side)
BC1  4.8,38.6 270 top
C1  6.2,41.8 270 top
C2  2.6,38.4 270 top
C3  11.2,28.2 0 top
C4  14.4,28.2 180 top
C5  19,19.4 270 top
C6  14.8,18.2 0 top
C7  8,41.4 270 top
C8  2.8,36 0 top
C9  39,23 180 top
D1  32.23,3 180 top
D4  22.43,3 180 top
D5  27.23,3 180 top
D6  38.03,3 180 top
D7  16.64,3 180 top
IC1  24.6,21.2 90 top
IC2  39.2,25.4 0 top
IR1  26,42.6 0 top
K1  25,9.6 180 top
L1  8.2,38 270 top
LED1  23.2,43.4 180 top
LED2  44.2,21.4 270 top
LS1  42.4,15 180 top
NAND1  19,42.4 180 top
PGA1  12.8,25.8 0 top
PIN1  5.6,5 90 bottom
PIN2  46.5,23.2 270 bottom
PIN3  46.5,14.9 270 bottom
PIN4  46.5,10.4 270 bottom
PIN5  46.5,25.7 270 bottom
PIN6  3.3,5 90 bottom
PIN7  37.2,14.2 0 top
PIN8  38,14.2 0 top
PIN9  38,17.4 0 top
PIN10  37.2,17.4 0 top
PIN11  32.63,17.8 0 top
PIN12  22.64,17.2 0 top
PIN13  21.84,17.2 0 top
PIN14  23.43,17.2 0 top
PIN15  21.04,17.2 0 top
PIN16  25.23,17.2 0 top
PIN17  26.04,17.2 0 top
PIN18  26.84,17.2 0 top
PIN19  27.64,17.2 0 top
PIN20  29.6,17 0 top
PIN21  36.4,17.4 0 top
PIN22  35.6,17.4 0 top
PIN23  33.44,17.8 0 top
PIN24  31.04,17.8 0 top
PIN25  31.84,17.8 0 top
PIN26  26,26 0 top
PIN28  16.43,17.2 0 top
PIN29  15.63,17.2 0 top
PIN30  18.84,16.4 0 top
PIN31  17.23,17.2 0 top
R1  2.8,40.8 180 top
R2  4.6,41.4 90 top
R3  6.6,27.4 270 top
R4  8.2,27.4 270 top
R5  17.2,19.4 180 top
R6  6.6,25 90 top
R7  8.2,25 90 top
R8  9.4,25 90 top
R9  9.4,27.4 270 top
R10  16.84,15.6 0 top
R11  22.23,15.6 0 top
R12  26.43,15.6 0 top
R13  32.23,15.6 0 top
R14  36.8,15.8 0 top
R15  44.8,18.4 90 top
R16  42.2,20.8 90 top
R17  21.65,42.55 90 top
R18  44,12.8 180 top
R19  39.8,20.8 270 top
R20  41,20.8 270 top
REF1  10,43 0 top
REF2  5,2 0 top
REF3  44,3 0 top
REF4  48,26.4 0 top
SJ1  41.4,23.4 270 top
SJ2  42.4,24.6 0 top
SJ3  42.4,25.8 0 top

### Tracks (layer width: path | path; a pad name or v marks a point on that pad's centre or on a via)
5VEN  (via drill 0.3)
  Top 0.3: IC1.20 25.57,24.77 v27.2,26.4 | v22.2,27.4 21.8,27.8 18.8,27.8 16,30.6 9.6,30.6 6,34.2 6,37.15 BC1.6
  Bottom 0.3: v27.2,26.4 27.2,26.6 26,27.8 22.6,27.8 v22.2,27.4
+3.3V/1  (via drill 0.3)
  Top 0.2: 23.6,40.6 24.2,40 26.4,40 26.75,40.35 IR1.4
  Top 0.3: D7.5 16.64,1 17.04,0.6 22.43,0.6 | 22.43,0.6 27.23,0.6 | 27.23,0.6 32.23,0.6 | 32.23,0.6 37.63,0.6 | 37.63,0.6 38.03,1 D6.5 | D4.5 22.43,0.6 | D5.5 27.23,0.6 | D1.5 32.23,0.6 | 49,12.8 49,21.8 v47.8,23 43.65,23 R16.2 R20.1 R19.1 39.8,22.9 C9.1 39.8,23.1 39.8,25.8 40.38,26.38 IC2.8 | 49,12.8 49,5.6 44,0.6 37.63,0.6 | v19.64,14 20.23,14.6 20.23,16.4 20.4,16.57 20.4,18.32 IC1.1 20.02,18.7 C5.2 18.65,18.7 R5.1 | 16.75,9.71 v16.64,9.6 | v14.6,40.6 15.6,41.6 17.5,41.6 NAND1.8 19.35,41.65 20.4,40.6 23.6,40.6 | IR1.5 IR1.4 26.75,41.85 26.2,42.4 25.2,42.4 24.65,41.8 R17.1 | R18.1 49,12.8 | v14.4,29.2 15.1,28.5 C4.1 15.1,27 PGA1.10
  Top 0.5: C1.1 6.1,40.15 | 6.1,40.15 BC1.1 | 6.1,40.15 7.15,39.1 L1.1 8,39.3 | K1.7 16.75,9.71
  Top 0.6: v14.6,40.6 8.2,40.6 C7.2 6.4,40.7 C1.1
  Bottom 0.3: PIN2._ 47.6,23.2 v47.8,23
  Bottom 0.5: PIN2._ 43.2,23.2 34,14 v19.64,14 | v16.64,9.6 19.64,12.6 v19.64,14 | 15.6,18.2 15.6,16.64 16.64,15.8 16.84,15.57 18.4,14 v19.64,14
  Bottom 0.6: v14.6,40.6 14.6,29.4 v14.4,29.2 14.4,27.8 15,27.2 15,25.2 16.8,23.4 17.4,23.4 18.2,22.6 18.2,20.8 15.6,18.2
+5V/1  (via drill 0.3)
  Top 0.3: R1.2 1.2,39.95 1.2,38.6 2.3,37.5 C2.1 2.8,37.7 BC1.4 | PGA1.1 10.8,26.9 10.5,27.2 C3.1 10.5,28.7 4.4,34.8 3.2,34.8 2.1,35.9 C8.1
  Top 0.5: v6,6.4 1.4,6.4 0.8,7 0.8,34.7 C8.1 2.1,37.3 2.3,37.5 | K1.24 38.34,5.87 v38.8,5.4 38.98,5.21 D6.1
  Bottom 0.5: v6,6.4 9,3.4 13.04,3.4 14.63,5 38.4,5 v38.8,5.4
+5V/2  (via drill 0.3)
  Top 0.3: D6.6 40.03,2.8 40.03,5.57 39.6,6 v39.6,9.8
  Top 0.5: v39.6,9.8 K1.25
  Bottom 0.5: PIN1._ 8.2,2.4 13.2,2.4 15,4.2 39,4.2 39.6,4.8 v39.6,9.8
CS_PGA  (via drill 0.3)
  Top 0.3: IC1.9 25.57,20.38 v25.4,20.6 | v17.2,26.8 16.4,26.8 15.9,26.3 PGA1.9
  Bottom 0.3: v25.4,20.6 24,20.6 22.8,21.8 22.4,21.8 17.4,26.8 v17.2,26.8
GND  (via drill 0.3)
  Top 0.3: PGA1.4 10.1,25.3 9.4,24.6 R8.1 R7.1 | LS1.1 44.75,14.25 v44.9,13.95 | v25.65,41.8 26,41.45 IR1.3 | 25.6,41.8 25.25,41.45 25.25,40.9 | v8.8,29.2 8.2,28.6 8.2,28.2
  Top 0.4: 10,23.6 9.6,23.2 8.2,23.2 8.2,24.2
  Top 0.5: BC1.3 3.95,39.3 C2.2 2.8,39.5 2.8,41.6 3.35,42.15 R2.2 | v10.6,23.6 10,23.6
  other vias: 4.45,5 3.2,3.8 2,5 16.64,3 22.43,3 27.23,3 32.23,3 38.03,3 13.04,5 29.43,15.6 13.63,16.2 6.8,30 13.6,19 4,30 12,31.4 12.8,28.2 35,27 45,27 11.8,29.2 20.4,26.4 25.2,43.4 26.8,43.4 13.2,41.6 9,42.2 4.6,43.2 3.6,38.45 7.8,43.2 3.4,42 13.04,9.8 40.84,9.8 42.63,7.4 48.2,21.4 39,17.4 42.6,19 37.2,23 13.84,1.4 7.24,1.4 36.6,18.8 32.6,22.8 39.03,14 45,24.4 13.6,31.4 13.6,39.6 13.15,43.9 17.35,44.1 13.63,14.2 2,24 34.44,17.2 38.6,24.4 36.4,24.4 42.8,27 43.8,25.8 43.8,24.6 42.4,23.6 41.4,22.4 6.2,44 40.84,5.2 9.63,4.4 47,6 42,2 8.04,5.8 11.84,4.4 8.2,23.4 9.4,23.4 2,27.4 4.4,36.65 38.2,22 45,22.4 46,21.4 48.2,19 48.2,13.6 48.2,12 41,12 4.6,35.85 2.75,28.95 13.2,21.4 12,22.8 20.4,43.8 19.2,40.6 13.6,29.2 10,31.4 13.8,27.2 11.8,27.2
  pour Top: 0,-2 50,-2 50,46 0,46
  pour Bottom: 0,-2 50,-2 50,46 0,46
GPIO0
  Top 0.3: R11.8 PIN15._ 21.02,17.21 IC1.2
GPIO1
  Top 0.3: R12.8 PIN16._ 24.6,17.2 24.27,17.52 IC1.7
GPIO2
  Top 0.3: R12.7 PIN17._ 26.23,17.39 IC1.10
GPIO3
  Top 0.3: R12.6 PIN18._ 26.88,17.24 IC1.11
GPIO4
  Top 0.3: R12.5 PIN19._ 27.52,17.31 IC1.12
GPIO5
  Top 0.3: R13.8 PIN24._ 31,18.2 29.2,20 27.4,20 25,22.4 21.6,22.4 21.02,22.98 IC1.27
GPIO6
  Top 0.3: IC1.26 21.68,23.12 21.8,23 25.2,23 27.6,20.6 29.6,20.6 31.8,18.4 31.8,17.8 PIN25._ R13.7
GPIO7
  Top 0.3: R13.6 PIN11._ 32.6,17.8 32.6,18.6 30,21.2 27.8,21.2 26.23,22.77 IC1.19
GPIO8
  Top 0.3: R13.5 PIN23._ 33.4,17.8 33.4,18.8 30.4,21.8 28,21.8 26.88,22.93 IC1.18
GPIO9
  Top 0.3: R14.8 PIN22._ 35.6,17.6 30.8,22.4 28.2,22.4 27.52,23.07 IC1.17
GPIO10
  Top 0.3: R14.7 PIN21._ 36.4,17.8 31.2,23 28.6,23 28.18,23.43 IC1.16
I2C_CLK  (via drill 0.3)
  Top 0.3: IC1.22 24.27,25.48 v24.8,26 26.2,27.4 31.6,27.4 33.7,25.3 | 33.7,25.3 38.2,20.8 40.25,20.8 R20.2 41.6,19.45 41.6,15.4 41.45,15.25 LS1.6 | IC2.2 34.12,25.73 33.7,25.3 | R10.6 PIN31._ 18.4,17.2 18.43,17.2 19,17.2 v19.2,17.4
  Bottom 0.3: v19.2,17.4 27,17.4 28.6,19 28.6,22.2 v24.8,26
I2C_DATA  (via drill 0.3)
  Top 0.3: R10.5 PIN30._ v19.43,16.4 | LS1.5 40.95,18.9 R19.2 39.75,20 | 39.75,20 39.8,20 | 39.75,20 37.95,20 32.35,25.6 v28.6,25.6 | IC1.23 23.62,26.98 v23.6,27 | IC2.1 33.83,26.38 v33.8,26.4
  Bottom 0.3: v19.43,16.4 19.84,16.8 27.2,16.8 29.2,18.8 29.2,22.4 27.2,24.4 | 27.2,24.4 26.2,25.4 26.2,26.4 25.6,27 v23.6,27 | 27.2,24.4 27.4,24.4 v28.6,25.6 33,25.6 v33.8,26.4
INT_JOLLA
  Top 0.3: IC1.15 32.55,24.05 37.6,19 39.8,19 40.2,18.6 40.2,13.8 42.4,11.6 43.4,11.6 44,12.2 44,13.4 43.8,13.6 43.4,13.6 42.2,14.8 42.2,17.6 43.4,18.8 R15.6
IR-R_CONT  (via drill 0.3)
  Top 0.3: IC1.13 28.18,19.23 28,19.4 26.8,19.4 v26.4,19.8 | v19.6,42.2 19.65,42.15 NAND1.2
  Bottom 0.3: v26.4,19.8 26.4,21 24.4,23 22.8,23 17.2,28.6 17.2,39.8 v19.6,42.2
IR-T_CONT  (via drill 0.3)
  Top 0.3: v24.4,21.6 24.4,19.8 24.93,19.27 IC1.8 | v18.8,42.8 18.65,42.65 NAND1.6
  Bottom 0.3: v24.4,21.6 23.6,22.4 22.6,22.4 16.6,28.4 16.6,40 18.8,42.2 v18.8,42.8
N$1
  Top 0.3: BC1.2 4.8,40.45 R2.1 3.7,40.65 R1.1
N$2
  Top 0.5: L1.2 7.5,36.9 5.8,38.6 5.2,38.6 4.8,38.2 BC1.5
N$3
  Top 0.3: IC2.7 42.02,25.73 SJ3.1
N$4
  Top 0.3: R3.2 R4.2 R9.2 9.75,26.65 10.1,26.3 PGA1.2
N$5
  Top 0.3: IC2.6 41.62,25.07 SJ2.1
N$6
  Top 0.3: IC1.14 28.8,18.32 28.8,18.2 29.6,17.4 PIN20._
N$7
  Top 0.3: R6.2 R7.2 R8.2 9.45,25.8 PGA1.3
N$8
  Top 0.3: D7.1 18.02,4.68 K1.8 18.02,13.42 17.23,14.2 R10.3
N$9
  Top 0.3: D7.6 19.29,3.45 K1.9 19.29,13.12 18.04,14.36 R10.4
N$10
  Top 0.3: D4.4 20.55,2.68 K1.10 20.55,13.36 21.04,13.84 R11.1
N$11
  Top 0.3: IC2.5 41.4,24.02 SJ1.1
N$12
  Top 0.3: D4.1 23.39,7.06 K1.12 23.09,13.54 22.64,14 R11.3
N$13
  Top 0.3: D4.6 24.36,2.73 K1.13 24.36,13.87 R11.4
N$14
  Top 0.3: D5.4 25.23,2.8 25.23,6.95 K1.14 25.64,13.37 25.2,13.8 25.2,14.77 R12.1
N$15
  Top 0.3: D5.3 26.29,5.25 26.91,5.87 K1.15 26.91,13.1 26,14 26,14.77 R12.2
N$16
  Top 0.3: D5.1 K1.16 28.18,13.03 26.84,14.36 R12.3
N$17
  Top 0.3: IC1.21 24.93,24.93 PIN26._
N$18
  Top 0.3: R17.2 22.35,43.3 LED1.A
N$19  (via drill 0.3)
  Top 0.3: R15.3 R15.4 v46.8,19.6
  Bottom 0.3: v46.8,19.6 47.6,19.6 49,21 49,24 47.3,25.7 PIN5._
N$21
  Top 0.3: LS1.2 43.25,14.75 42.8,15.2 42.8,16.4 43.6,17.2 R15.8 R15.7 44.4,18 44.8,18.4 44.8,20 44.6,20.2 44.05,20.2 LED2.A 42.75,20.6 R16.1
N$24
  Top 0.3: D7.4 14.21,3.23 K1.5 14.21,13.01 15.63,14.43 R10.1
N$25
  Top 0.3: D7.3 15.47,4.46 K1.6 15.47,13.24 16.43,14.2 R10.2
N$26
  Top 0.3: D4.3 21.48,5.25 21.82,5.59 K1.11 21.82,13.19 R11.2
N$27
  Top 0.3: D5.6 29.45,3.01 K1.17 29.45,12.99 R12.4
N$28
  Top 0.3: D1.4 30.23,2.8 30.23,6.87 K1.18 30.71,14.48 R13.1
N$29
  Top 0.3: D1.3 31.29,5.25 31.4,5.4 31.98,5.99 K1.19 31.84,12 R13.2
N$30
  Top 0.3: D1.1 33.19,7.28 K1.20 33.26,13.58 32.63,14.2 R13.3
N$31
  Top 0.3: D1.6 34.52,3.09 K1.21 34.52,13.71 R13.4
N$32
  Top 0.3: D6.4 35.8,3.04 K1.22 35.8,13.8 35.6,14 R14.1
N$33
  Top 0.3: D6.3 37.06,4.27 K1.23 37.06,13.34 36.4,14 R14.2
N$34
  Top 0.3: PIN7._ R14.3
N$35
  Top 0.3: PIN8._ R14.4
N$36
  Top 0.3: PIN9._ R14.5
N$37
  Top 0.3: PIN10._ R14.6
N$38
  Top 0.3: IR1.1 24.18,41.2 20.8,41.2 20.45,41.55 NAND1.1
N$39
  Top 0.3: NAND1.3 20.95,42.65 21,42.6 23.15,42.6 LED1.C
N$40  (via drill 0.3)
  Top 0.3: LS1.4 44.1,16 v44.8,16 44.8,17.6 45.2,18 R15.2
  Bottom 0.3: v44.8,16 45.2,16 46.3,14.9 PIN3._
N$42
  Top 0.3: LS1.7 LS1.8 41.8,14.25 R18.2
N$43  (via drill 0.3)
  Top 0.3: v46.4,13.8 46,13.8 45,14.8 | 45,14.8 44.55,15.25 LS1.3 | 45,14.8 45.6,15.4 R15.1
  Bottom 0.3: PIN4._ 46.4,10.3 | 46.4,10.3 46.4,10.2 | 46.4,10.3 v46.4,13.8
RST  (via drill 0.3)
  Top 0.3: R10.8 PIN29._ 15.63,18.07 C6.2 | v22.8,25.4 22.98,25.23 IC1.24 | 15.7,18.4 C6.2 | v17.2,18.6 16.4,18.6 | 16.4,18.6 15.9,18.6 C6.2 | R5.2 16.45,18.65 16.4,18.6
  Bottom 0.3: v17.2,18.6 17.6,19 19.6,19 20,18.6 26.6,18.6 27.4,19.4 27.4,21.4 24.8,24 24.2,24 v22.8,25.4
SENS+
  Top 0.3: K1.2 7.45,7.35 4,10.8 4,26.6 5.55,28.15 R3.1
SENS-
  Top 0.3: K1.1 9.12,13.47 6.6,16 R6.1
SPI_SIMO  (via drill 0.3)
  Top 0.3: R11.6 PIN12._ 22.32,17.51 IC1.4 22.32,20.27 v22.12,20.48 | NAND1.5 16.95,43.15 v16.6,43.2 | PGA1.8 16.4,25.8 v16.6,26
  Bottom 0.3: v22.12,20.48 21.6,21 21,21 20.6,21.4 20.6,22 17.8,24.8 17.4,24.8 16.6,25.6 v16.6,26 16.6,27.6 16,28.2 16,40.2 16.6,40.8 v16.6,43.2
SPI_SOMI  (via drill 0.3)
  Top 0.3: R11.7 PIN13._ 21.68,17.36 IC1.3 21.68,19.73 v21.48,19.93 | NAND1.7 16.05,42.15 v16,42.2
  Bottom 0.3: v16,42.2 16,41.2 15.4,40.6 15.4,28 15.8,27.6 15.8,25.6 17.2,24.2 17.6,24.2 20,21.8 20,21.2 20.8,20.4 21,20.4 v21.48,19.93
SPICLK  (via drill 0.3)
  Top 0.3: R11.5 PIN14._ 23.62,17.39 IC1.6 23.62,20.98 22.8,21.8 v21.4,21.8 | v17.6,25.6 17.4,25.6 17,25.2 15.6,25.2 15.5,25.3 PGA1.7
  Bottom 0.3: v21.4,21.8 21.4,22 18,25.4 17.8,25.6 v17.6,25.6
TST  (via drill 0.3)
  Top 0.3: PIN28._ R10.7 | v21.2,25.8 22.32,24.68 IC1.25 | PIN28._ 16.43,17.16 | PIN28._ 16.43,17.43 16.8,17.8 18.2,17.8 v18.4,18
  Bottom 0.3: v18.4,18 18.6,18.2 19.6,18.2 19.8,18 26.8,18 28,19.2 28,21.6 25,24.6 24.8,24.6 23.2,26.2 21.6,26.2 v21.2,25.8
VAD_SENSE  (via drill 0.3)
  Top 0.3: IC1.5 22.98,20.82 22.6,21.2 21.8,21.2 21.6,21 21.2,21 19.8,22.4 v17.2,22.4 | v11.8,24.8 PGA1.5
  Bottom 0.3: v17.2,22.4 17,22.6 16.4,22.6 14.2,24.8 v11.8,24.8

### Text on the board
bStop: Jolla - Breakoutboard / V2-2015-04-10